# EAGLE design Controller Board v8 (EAGLE 5.06)
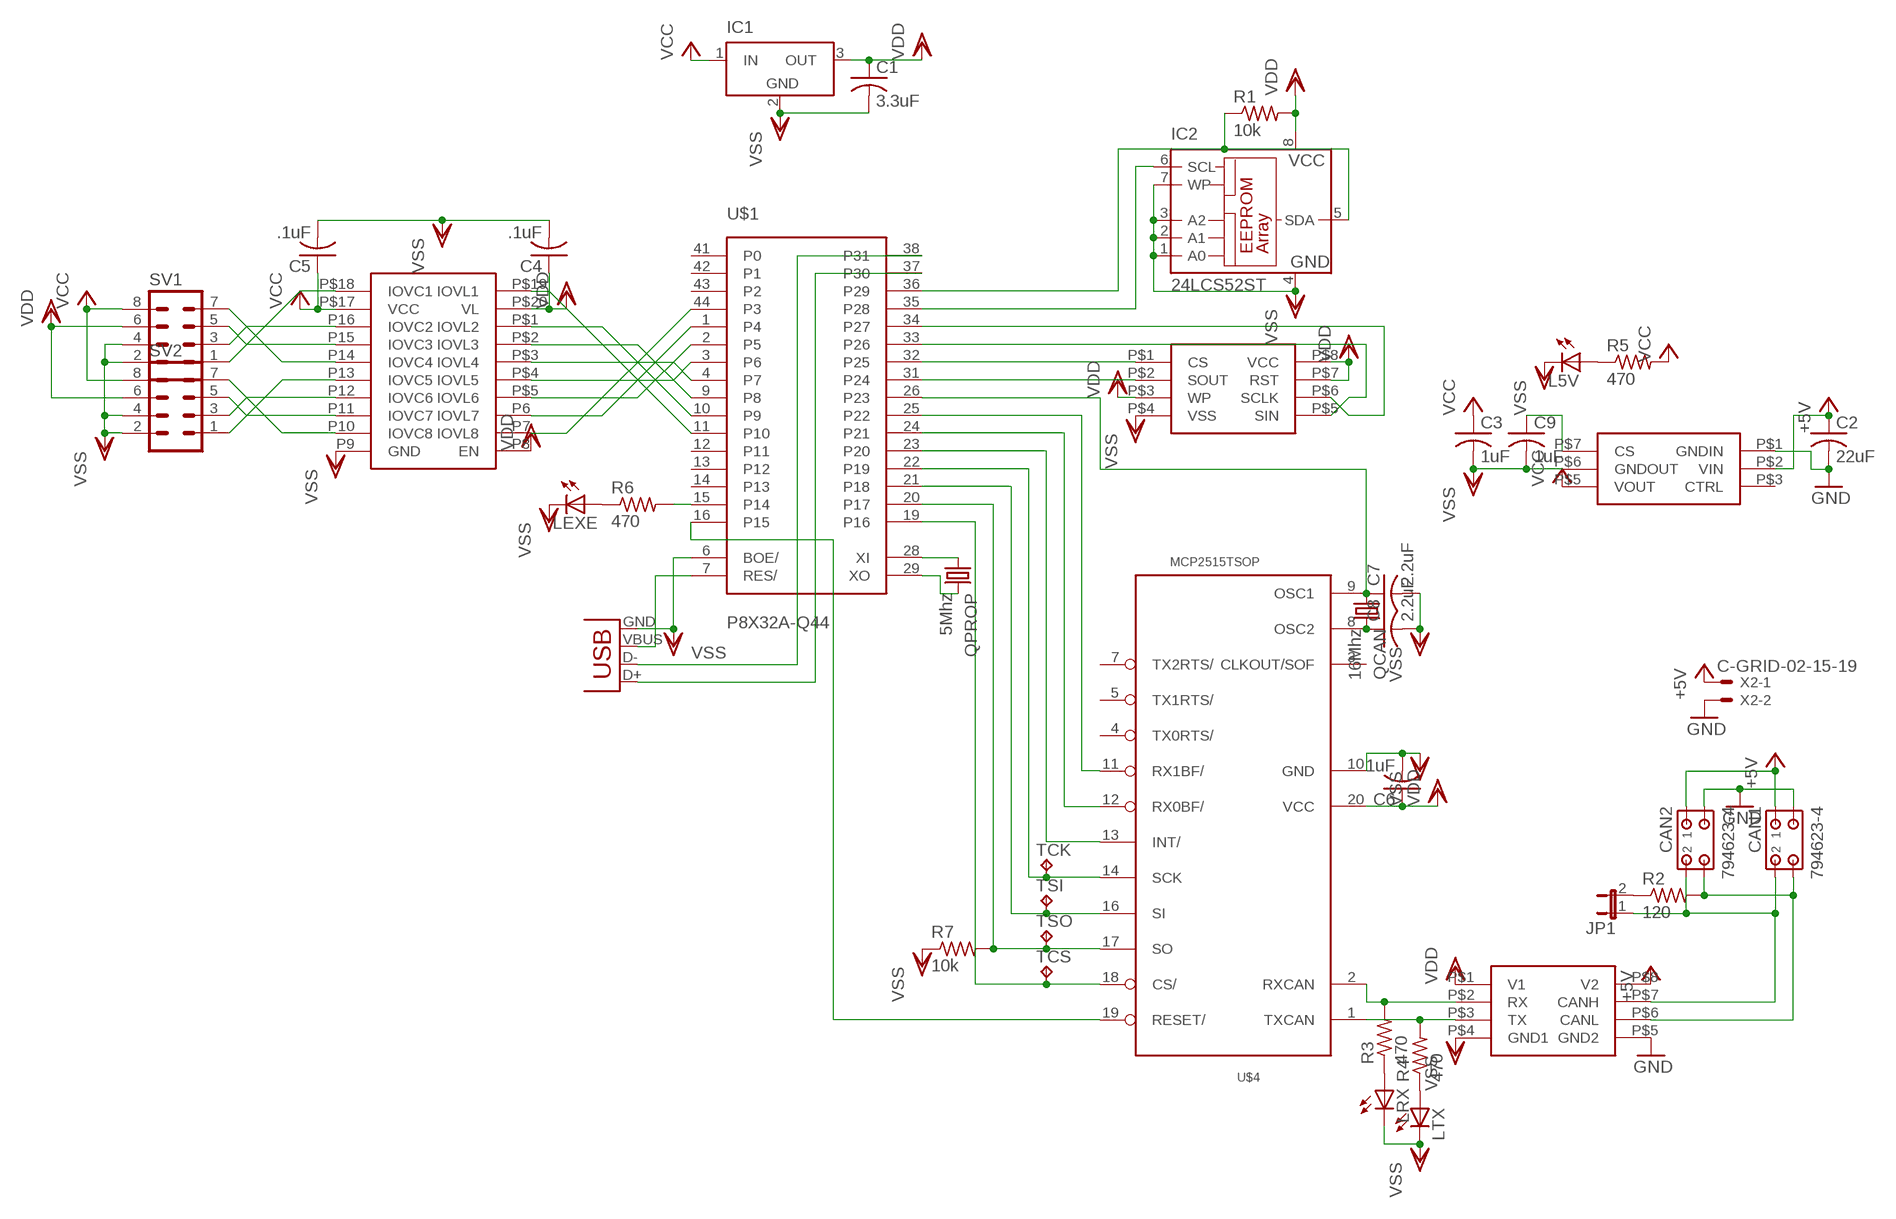
[diagram p0: schematic, sheet 1]

## Parts
C1  3.3uF  C-USC0805  [C0805]
C2  22uF  C-USC1210  [C1210]
C3  1uF  C-USC1210  [C1210]
C4  .1uF  C-USC0805  [C0805]
C5  .1uF  C-USC0805  [C0805]
C6  1uF  C-USC0805  [C0805]
C7  2.2uF  C-USC0805  [C0805]
C8  2.2uF  C-USC0805  [C0805]
C9  1uF  C-USC1210  [C1210]
CAN1  794623-4  [794623-4]
CAN2  794623-4  [794623-4]
IC1  LT1129CST5  [SOT223]
IC2  24LCS52ST  [TSSOP8]
JP1  JP1E  [JP1]
L5V  LEDCHIP-LED0805  [CHIP-LED0805]
LEXE  LEDCHIP-LED0805  [CHIP-LED0805]
LRX  LEDCHIP-LED0805  [CHIP-LED0805]
LTX  LEDCHIP-LED0805  [CHIP-LED0805]
QCAN  16Mhz  CRYSTALHC49UP  [HC49UP]
QPROP  5Mhz  CRYSTALHC49UP  [HC49UP]
R1  10k  R-US_R0603  [R0603]
R2  120  R-US_R0603  [R0603]
R3  470  R-US_R0603  [R0603]
R4  470  R-US_R0603  [R0603]
R5  470  R-US_R0603  [R0603]
R6  470  R-US_R0603  [R0603]
R7  10k  R-US_R0603  [R0603]
SV1  MA04-2  [MA04-2]
SV2  MA04-2  [MA04-2]
TCK  TPPAD1-13  [P1-13]
TCS  TPPAD1-13  [P1-13]
TSI  TPPAD1-13  [P1-13]
TSO  TPPAD1-13  [P1-13]
U$1  P8X32A-Q44  [P8X32A-Q44]
U$2  VINF-VWRBS2  [VINF-VWRBS2]
U$3  TI-ISO1050  [DUB-8]
U$4  MCP2515TSOP  [TSSOP20]
U$5  M25PE20  [S08N]
U$6  MAX3000E  [TQFN-20]
X1  USBSMD  [USB-MINIB]
X2  C-GRID-02-15-19  [15-91-02]

## Nets
+5V: C2.1 CAN1.1 CAN2.1 U$2.P$2(VIN) U$3.P$8(V2) X2.1
FLASHCLK: U$1.34(P27) U$5.P$6(SCLK)
FLASHSIN: U$1.33(P26) U$5.P$5(SIN)
GND: C2.2 CAN1.3 CAN2.3 U$2.P$1(GNDIN) U$3.P$5(GND2) X2.2
N$1: QPROP.1 U$1.28(XI)
N$2: QPROP.2 U$1.29(XO)
N$3: IC2.6(SCL) U$1.35(P28)
N$4: IC2.5(SDA) R1.1 U$1.36(P29)
N$5: U$1.7(RES/) X1.VBUS
N$6: U$1.38(P31) X1.D-
N$7: U$1.37(P30) X1.D+
N$8: U$1.25(P22) U$4.11(RX1BF/)
N$9: U$1.24(P21) U$4.12(RX0BF/)
N$10: CAN1.4 CAN2.4 R2.2 U$3.P$6(CANL)
N$11: CAN1.2 CAN2.2 JP1.1 U$3.P$7(CANH)
N$12: R6.2 U$1.15(P14)
N$13: C9.1 U$2.P$7(CS)
N$14: U$1.32(P25) U$5.P$1(CS)
N$15: U$1.31(P24) U$5.P$2(SOUT)
N$16: U$1.23(P20) U$4.13(INT/)
N$17: TCK.1(TP) U$1.22(P19) U$4.14(SCK)
N$18: C7.1 QCAN.1 U$1.26(P23) U$4.9(OSC1)
N$19: C8.1 QCAN.2 U$4.8(OSC2)
N$20: R3.2 U$3.P$2(RX) U$4.2(RXCAN)
N$21: R4.2 U$3.P$3(TX) U$4.1(TXCAN)
N$22: JP1.2 R2.1
N$23: TSI.1(TP) U$1.21(P18) U$4.16(SI)
N$24: TCS.1(TP) U$1.19(P16) U$4.18(CS/)
N$25: U$1.16(P15) U$4.19(RESET/)
N$26: LRX.A R3.1
N$27: U$1.11(P10) U$6.P$19(IOVL1)
N$28: SV2.7 U$6.P10(IOVC8)
N$29: SV2.5 U$6.P11(IOVC7)
N$30: U$1.10(P9) U$6.P$1(IOVL2)
N$31: U$1.9(P8) U$6.P$2(IOVL3)
N$32: U$1.4(P7) U$6.P$3(IOVL4)
N$33: U$1.3(P6) U$6.P$4(IOVL5)
N$34: U$1.2(P5) U$6.P$5(IOVL6)
N$35: U$1.1(P4) U$6.P6(IOVL7)
N$36: U$1.44(P3) U$6.P7(IOVL8)
N$37: SV2.3 U$6.P12(IOVC6)
N$38: SV2.1 U$6.P13(IOVC5)
N$39: SV1.7 U$6.P14(IOVC4)
N$40: SV1.1 U$6.P$18(IOVC1)
N$41: SV1.3 U$6.P16(IOVC2)
N$42: SV1.5 U$6.P15(IOVC3)
N$44: R7.2 TSO.1(TP) U$1.20(P17) U$4.17(SO)
N$46: LTX.A R4.1
N$47: L5V.A R5.1
N$48: LEXE.A R6.1
VCC: C3.1 C5.1 IC1.1(IN) R5.2 SV1.8 SV2.8 U$2.P$5(VOUT) U$6.P$17(VCC)
VDD: C1.1 C4.1 C6.1 IC1.3(OUT) IC2.8(VCC) R1.2 SV1.6 SV2.6 U$3.P$1(V1) U$4.20(VCC) U$5.P$3(WP) U$5.P$7(RST) U$5.P$8(VCC) U$6.P8(EN) U$6.P$20(VL)
VSS: C1.2 C3.2 C4.2 C5.2 C6.2 C7.2 C8.2 C9.2 IC1.2(GND) IC2.1(A0) IC2.2(A1) IC2.3(A2) IC2.4(GND) IC2.7(WP) L5V.C LEXE.C LRX.C LTX.C R7.1 SV1.2 SV1.4 SV2.2 SV2.4 U$1.6(BOE/) U$2.P$6(GNDOUT) U$3.P$4(GND1) U$4.10(GND) U$5.P$4(VSS) U$6.P9(GND) X1.GND
Unconnected: U$1.12(P11) U$1.13(P12) U$1.14(P13) U$1.41(P0) U$1.42(P1) U$1.43(P2) U$2.P$3(CTRL) U$4.3(CLKOUT/SOF) U$4.4(TX0RTS/) U$4.5(TX1RTS/) U$4.7(TX2RTS/)

## Power pins joined to a net without a drawn wire
VDD: U$1.8(VDD) U$1.18(VDD) U$1.30(VDD) U$1.40(VDD)
VSS: IC1.4(GND) U$1.5(VSS) U$1.17(VSS) U$1.27(VSS) U$1.39(VSS)

## Library data of the parts
C1-C9 = rcl:C-US: CAPACITOR, American symbol
CAN1 CAN2 = con-amp:794623-4: MICRO MATE N LOK Dual Row, grid 1.5 mm Source: http://catalog.tycoelectronics.com .. ENG_CD_794623_F.pdf
IC1 = linear-technology:LT1129CST5: VOLTAGE REGULATOR with shutdown
IC2 = microchip:24*: Serial EEPROM I2C
JP1 = jumper:JP1E: JUMPER
L5V LEXE LRX LTX = led:LED: LED OSRAM: - CHIPLED LG R971, LG N971, LY N971, LG Q971, LY Q971, LO R971, LY R971 LH N974, LH R974 LS Q976, LO Q976, LY Q976 LO Q996 - Hyper CHIPLED LW Q18S LB Q993, LB Q99A, LB R99A - SideLED LS A670, LO A670, LY A670, LG A670, LP A670 LB A673, LV A673, LT A673, LW A673 LH A674 LY A675 LS A676, LA A676, LO A676, LY A676, LW A676 LS A679, LY A679, LG A679 - Hyper Micro SIDELED® LS Y876, LA Y876, LO Y876, LY Y876 LT Y87S - SmartLED LW L88C, LW L88S LB L89C, LB L89S, LG L890 LS L89K, LO L89K, LY L89K LS L896, LA L896, LO L896, LY L896 - TOPLED LS T670, LO T670, LY T670, LG T670, LP T670 LSG T670, LSP T670, LSY T670, LOP T670, LYG T670 LG T671, LOG T671, LSG T671 LB T673, LV T673, LT T673, LW T673 LH T674 LS T676, LA T676, LO T676, LY T676, LB T676, LH T676, LSB T676, LW T676 LB T67C, LV T67C, LT T67C, LS T67K, LO T67K, LY T67K, LW E67C LS E67B, LA E67B, LO E67B, LY E67B, LB E67C, LV E67C, LT E67C LW T67C LS T679, LY T679, LG T679 LS T770, LO T770, LY T770, LG T770, LP T770 LB T773, LV T773, LT T773, LW T773 LH T774 LS E675, LA E675, LY E675, LS T675 LS T776, LA T776, LO T776, LY T776, LB T776 LHGB T686 LT T68C, LB T68C - Hyper Mini TOPLED® LB M676 - Mini TOPLED Santana® LG M470 LS M47K, LO M47K, LY M47K Source: http://www.osram.convergy.de LUXEON: - LUMILED® LXK2-PW12-R00, LXK2-PW12-S00, LXK2-PW14-U00, LXK2-PW14-V00 LXK2-PM12-R00, LXK2-PM12-S00, LXK2-PM14-U00 LXK2-PE12-Q00, LXK2-PE12-R00, LXK2-PE12-S00, LXK2-PE14-T00, LXK2-PE14-U00 LXK2-PB12-K00, LXK2-PB12-L00, LXK2-PB12-M00, LXK2-PB14-N00, LXK2-PB14-P00, LXK2-PB14-Q00 LXK2-PR12-L00, LXK2-PR12-M00, LXK2-PR14-Q00, LXK2-PR14-R00 LXK2-PD12-Q00, LXK2-PD12-R00, LXK2-PD12-S00 LXK2-PH12-R00, LXK2-PH12-S00 LXK2-PL12-P00, LXK2-PL12-Q00, LXK2-PL12-R00 Source: www.luxeon.com KINGBRIGHT: KA-3528ASYC Source: www.kingbright.com
QCAN QPROP = crystal:CRYSTAL: CRYSTAL
R1-R7 = rcl:R-US_: RESISTOR, American symbol
SV1 SV2 = con-lstb:MA04-2: PIN HEADER
TCK TCS TSI TSO = testpad:TP: Test pad
U$1 = parallax_propeller:P8X32A-Q44
U$2 = dc-dc-converter:VINF-VWRBS2
U$3 = isodcdc:TI-ISO1050
U$4 = MCP2515_MT:MCP2515*: MCP2515 Standalone CAN-Controller by Microchip Eagle-Lib. by MartinThomas
U$5 = Flash:M25PE20
U$6 = Level Shifters:MAX3000E
X1 = SparkFun:USB: USB Connectors USB-B-PTH is fully proven SKU : PRT-00139 USB-miniB is fully proven SKU : PRT-00587 USB-A-PCB is untested. USB-A-H is throughly reviewed, but untested. Spark Fun Electronics SKU : PRT-00437 USB-B-SMT is throughly reviewed, but untested. Needs silkscreen touching up. USB-A-S has not been used/tested USB-MB-H has not been used/tested
X2 = con-molex:C-GRID-02: CONNECTOR wire to board 2.54 mm (0.100") pitch header

## Board
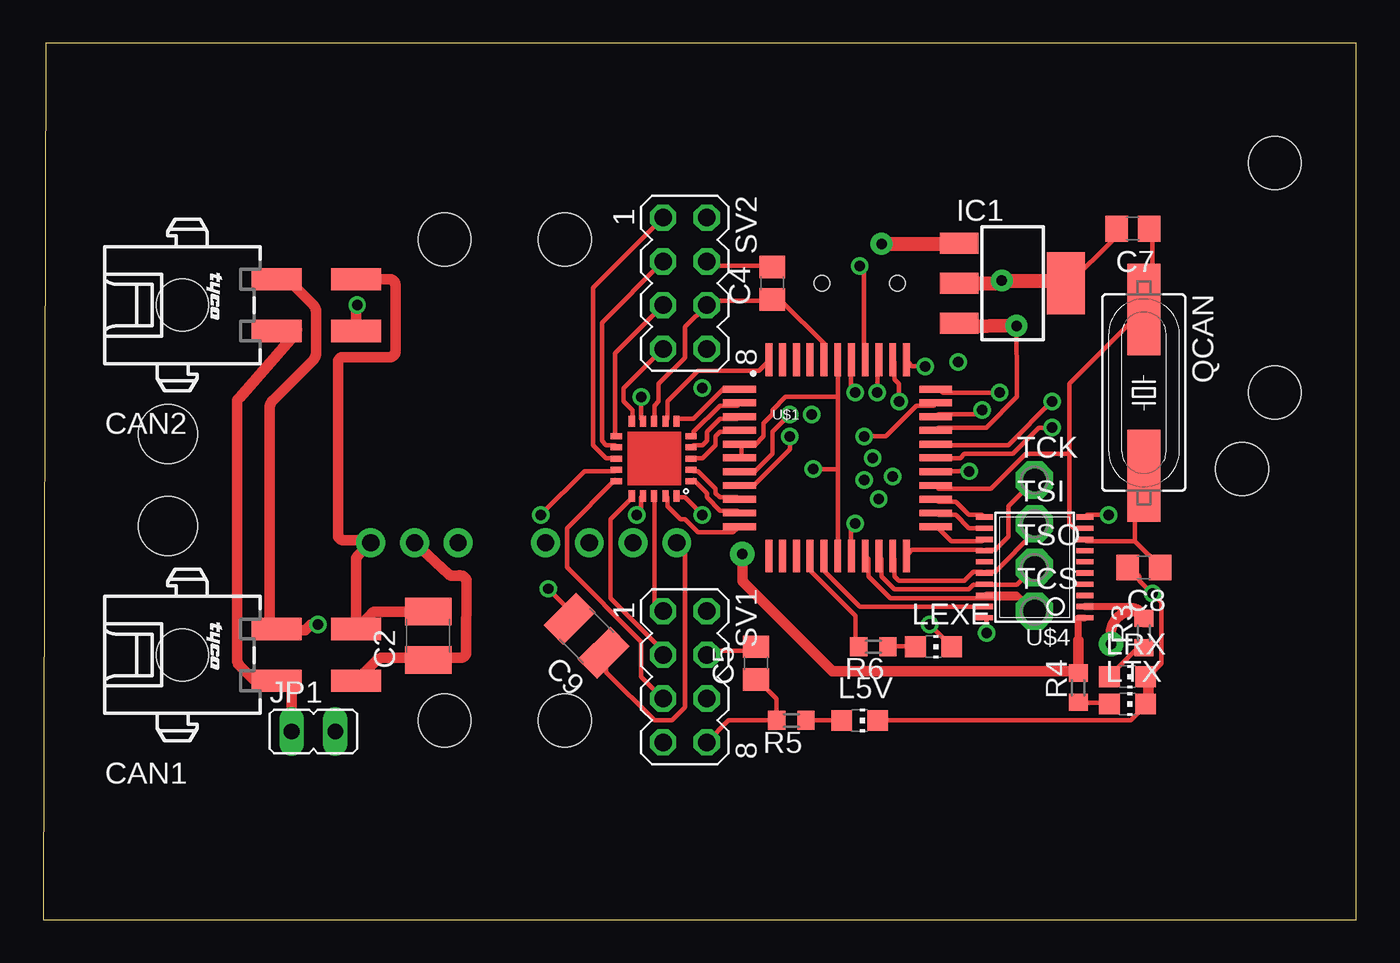
[diagram p1: board, top side]
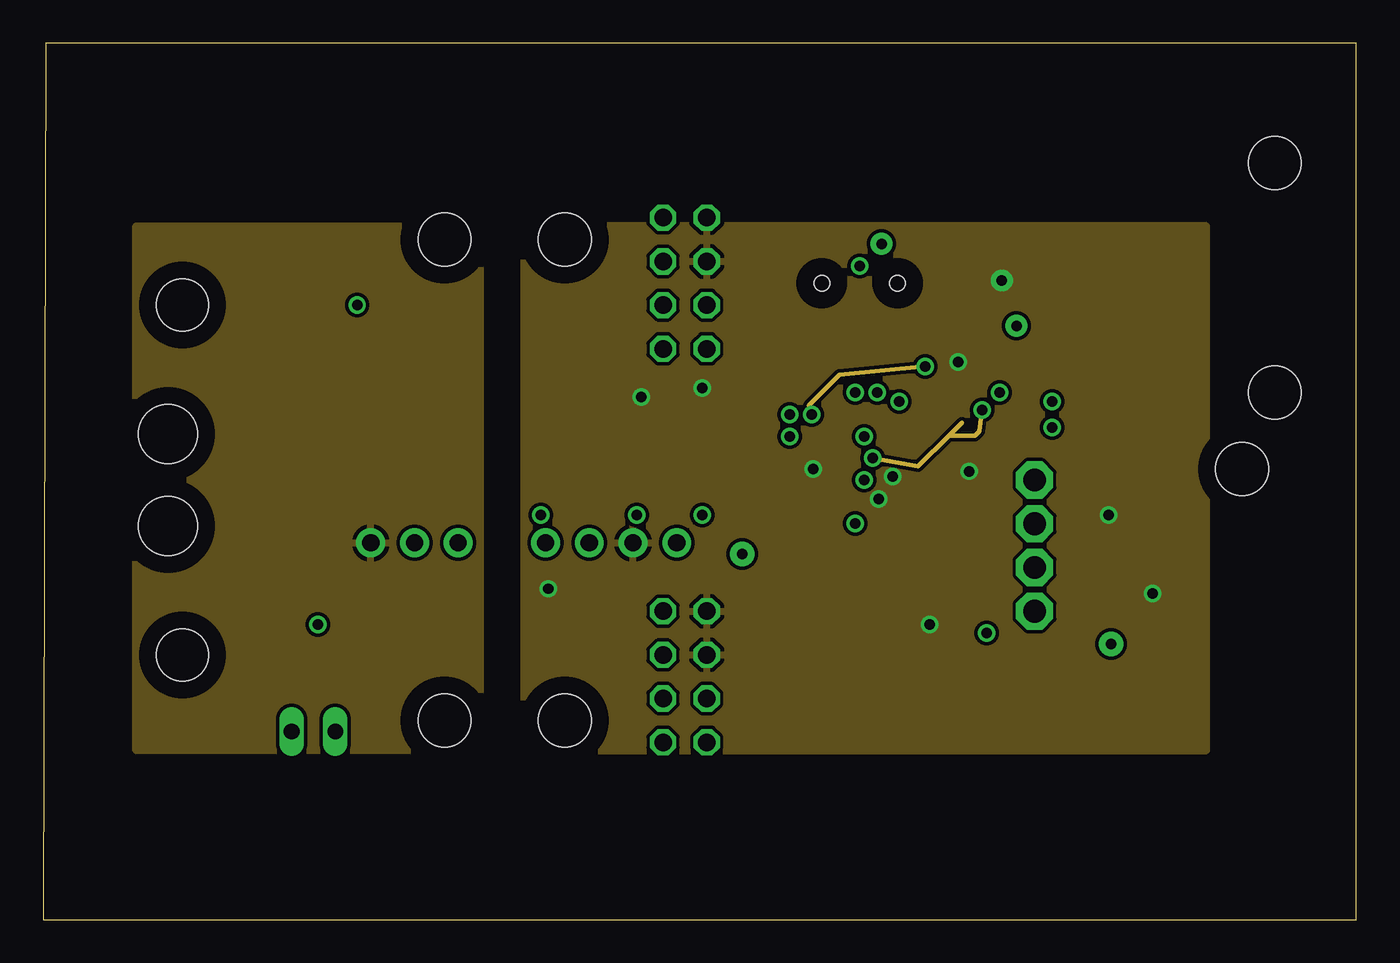
[diagram p2: board, inner layer Route2]
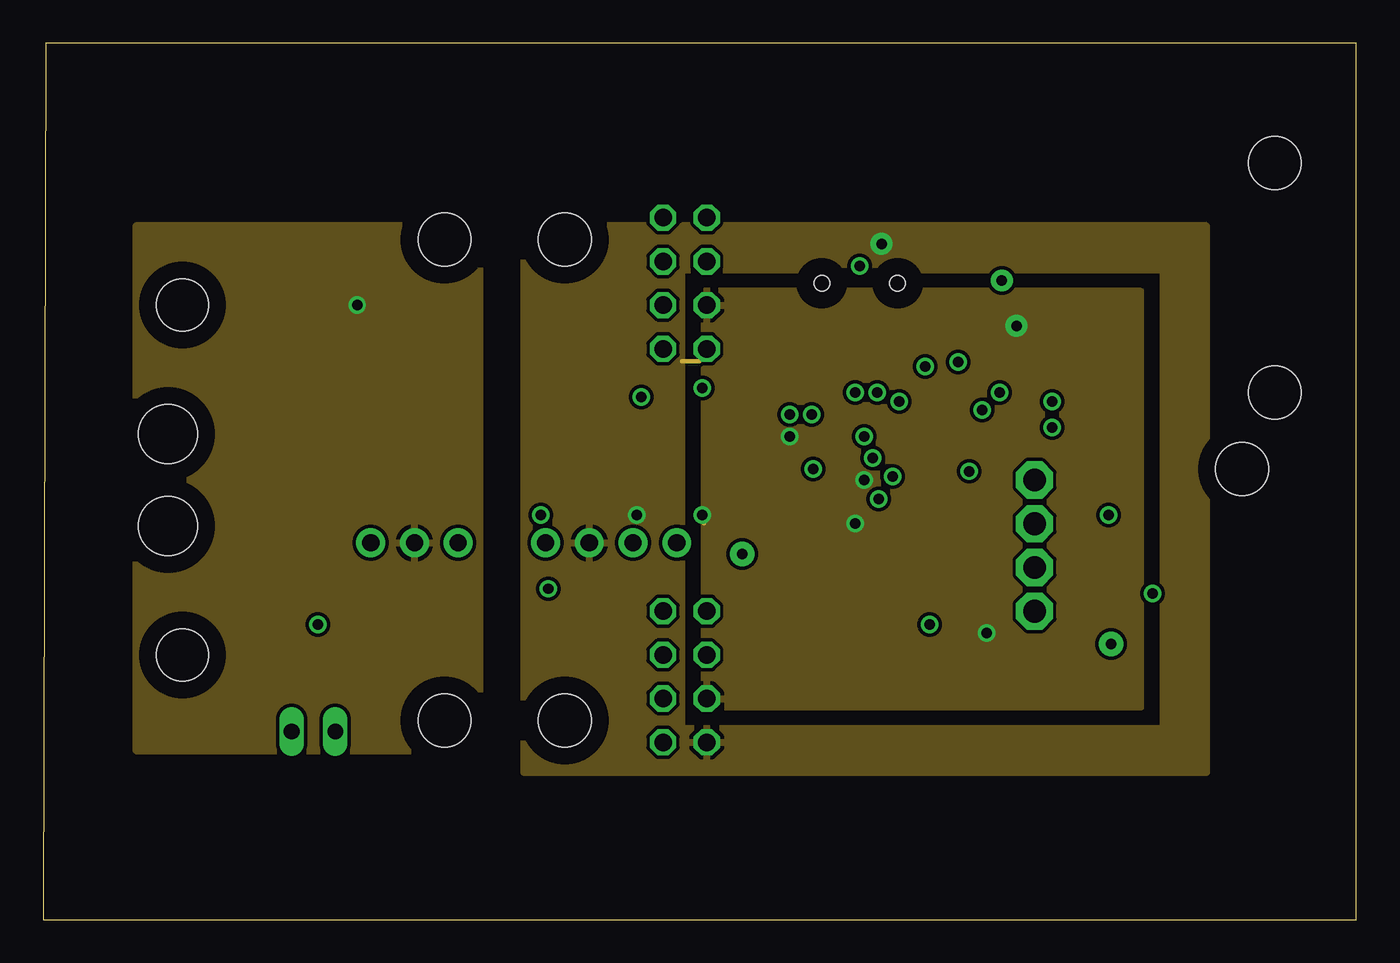
[diagram p3: board, inner layer Route15]
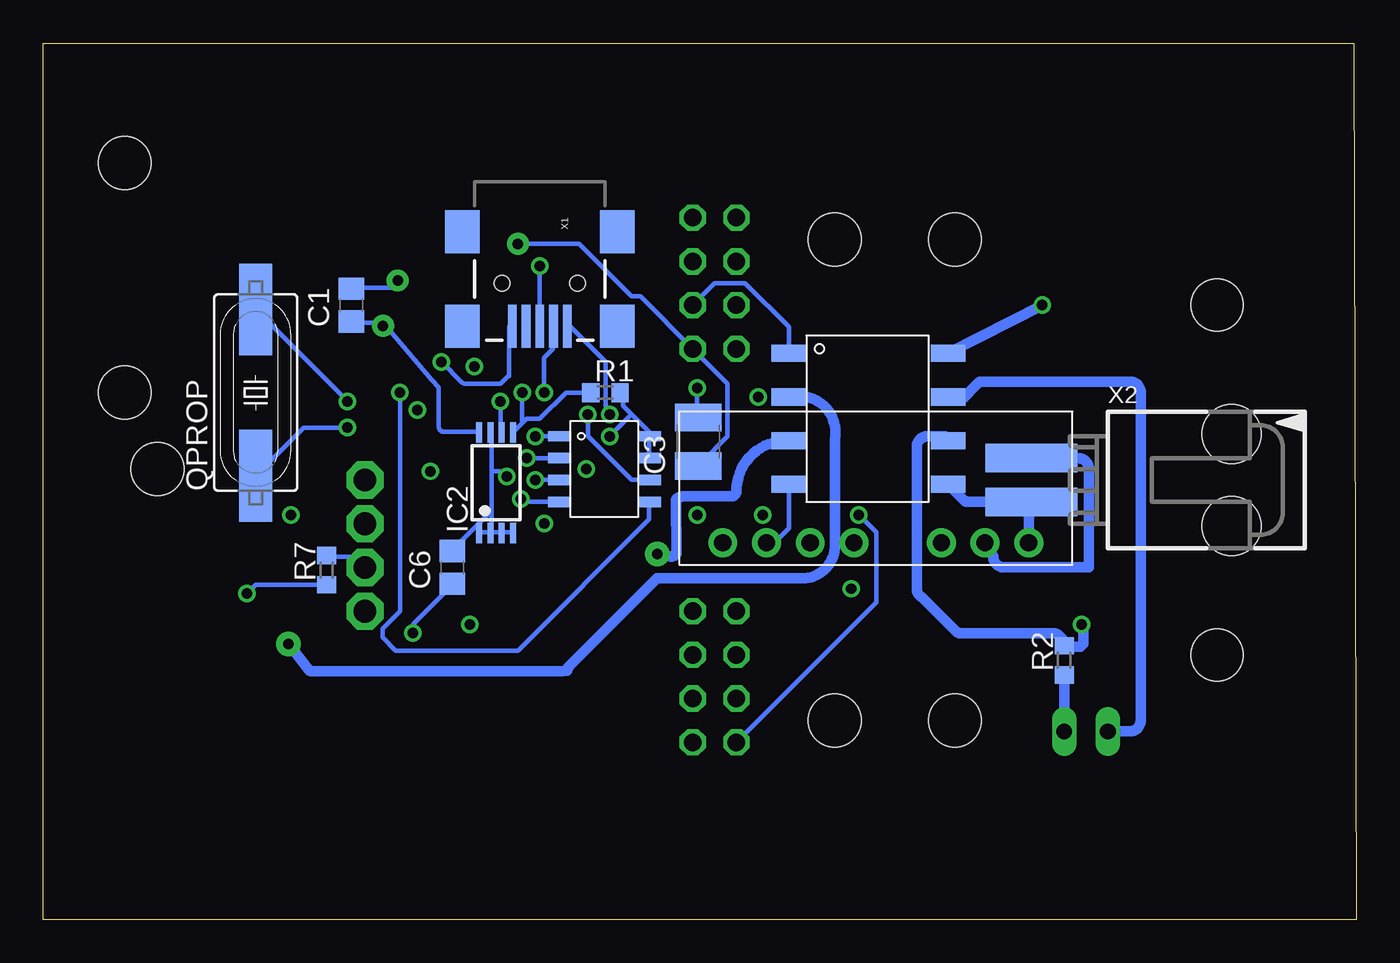
[diagram p4: board, bottom side, seen from below]

Size 76.34 x 50.95 mm. Coordinates in mm from the lower left corner, seen from the top.
Outline: 0,0 76.34,0 76.34,50.95 0.16,50.95 0,0
Copper layers (1*2+15*16): Top 0.035mm / dielectric 0.2mm / Route2 0.035mm / dielectric 1.5mm / Route15 0.035mm / dielectric 0.2mm / Bottom 0.035mm
Design rules "4 layer": minimum track width 10mil, minimum drill 24mil, track to track 8mil, track to pad 8mil, pad to pad 8mil, via to via 8mil, smd to smd 8mil, copper to edge 40mil, drill to drill 8mil, minimum pad ring 10mil, minimum via ring 8mil, stop-mask expansion 4mil, vias tented up to drill 0mil, thermal gap 10mil
Holes 3.05 mm at 71.6,30.64 71.6,43.97 30.32,39.53 30.32,11.59 69.69,26.19 23.34,39.53 23.34,11.59
tRestrict: area 26.5,12.9 to 27.1,38.9

### Footprints (pad centres in the part's own frame; a part is rotated, then mirrored left to right if it is on the bottom)
C0805 = smd 1.3 x 1.5: 1 -0.95,0; 2 0.95,0
C1210 = smd 1.6 x 2.7: 1 -1.4,0; 2 1.4,0
794623-4 = smd 1.3 x 2.92: 1 1.5,10.1; 2 1.5,5.48; 3 -1.5,10.1; 4 -1.5,5.48 | hole 3: 0,0
SOT223 = smd 1.219 x 2.235: 1 -2.311,-3.099; 2 0,-3.099; 3 2.311,-3.099 | smd 3.6 x 2.2: 4 0,3.099
TSSOP8 = smd 0.35 x 1.2: 1 -0.975,-2.925; 2 -0.325,-2.925; 3 0.325,-2.925; 4 0.975,-2.925; 5 0.975,2.925; 6 0.325,2.925; 7 -0.325,2.925; 8 -0.975,2.925
JP1 = drill 0.914 long: 1 0,-1.27; 2 0,1.27
CHIP-LED0805 = smd 1.2 x 1.2: A 0,-1.05; C 0,1.05
HC49UP = smd 5.334 x 1.93: 1 -4.826,0; 2 4.826,0
R0603 = smd 1 x 1.1: 1 -0.85,0; 2 0.85,0
MA04-2 = drill 1.016 octagon: 1 -3.81,-1.27; 2 -3.81,1.27; 3 -1.27,-1.27; 4 -1.27,1.27; 5 1.27,-1.27; 6 1.27,1.27; 7 3.81,-1.27; 8 3.81,1.27
P1-13 = drill 1.321 pad 2.159 octagon: 1 0,0
P8X32A-Q44 = smd 1.9 x 0.4: 1 -5.713,4.013; 2 -5.713,3.212; 3 -5.713,2.413; 4 -5.713,1.613; 5 -5.713,0.812; 6 -5.713,0.013; 7 -5.713,-0.787; 8 -5.713,-1.587; 9 -5.713,-2.388; 10 -5.713,-3.188; 11 -5.713,-3.987; 23 5.688,-3.987; 24 5.688,-3.188; 25 5.688,-2.388; 26 5.688,-1.587; 27 5.688,-0.787; 28 5.688,0.013; 29 5.688,0.812; 30 5.688,1.613; 31 5.688,2.413; 32 5.688,3.212; 33 5.688,4.013 | smd 0.4 x 1.9: 12 -4.013,-5.688; 13 -3.212,-5.688; 14 -2.413,-5.688; 15 -1.613,-5.688; 16 -0.812,-5.688; 17 -0.013,-5.688; 18 0.787,-5.688; 19 1.587,-5.688; 20 2.388,-5.688; 21 3.188,-5.688; 22 3.987,-5.688; 34 3.987,5.713; 35 3.188,5.713; 36 2.388,5.713; 37 1.587,5.713; 38 0.787,5.713; 39 -0.013,5.713; 40 -0.812,5.713; 41 -1.613,5.713; 42 -2.413,5.713; 43 -3.212,5.713; 44 -4.013,5.713
VINF-VWRBS2 = drill 1 pad 1.676 round: P$1 -12.7,5.08; P$2 -10.16,5.08; P$3 -7.62,5.08; P$4 -2.54,5.08; P$5 0,5.08; P$6 2.54,5.08; P$7 5.08,5.08
DUB-8 = smd 2 x 1: P$1 -4.572,3.556; P$2 -4.572,1.016; P$3 -4.572,-1.524; P$4 -4.572,-4.064; P$5 4.678,-4.064; P$6 4.678,-1.524; P$7 4.678,1.016; P$8 4.678,3.556
TSSOP20 = smd 0.305 x 0.991: 1 -2.925,-2.918; 2 -2.275,-2.918; 3 -1.625,-2.918; 4 -0.975,-2.918; 5 -0.325,-2.918; 6 0.325,-2.918; 7 0.975,-2.918; 8 1.625,-2.918; 9 2.275,-2.918; 10 2.925,-2.918; 11 2.925,2.918; 12 2.275,2.918; 13 1.625,2.918; 14 0.975,2.918; 15 0.325,2.918; 16 -0.325,2.918; 17 -0.975,2.918; 18 -1.625,2.918; 19 -2.275,2.918; 20 -2.925,2.918
S08N = smd 0.6 x 1.3: P$1 -2.54,-2.667; P$2 -1.27,-2.667; P$3 0,-2.667; P$4 1.27,-2.667; P$5 1.27,2.587; P$6 0,2.587; P$7 -1.27,2.587; P$8 -2.54,2.587
TQFN-20 = smd 0.65 x 0.35: P6 0.875,-1.1; P7 0.875,-0.45; P8 0.875,0.2; P9 0.875,0.85; P10 0.875,1.5; P16 -3.475,1.5; P$17 -3.475,0.85; P$18 -3.475,0.2; P$19 -3.475,-0.45; P$20 -3.475,-1.1 | smd 0.35 x 0.65: P11 0,2.4; P12 -0.65,2.4; P13 -1.3,2.4; P14 -1.95,2.4; P15 -2.6,2.4; P$1 -2.6,-1.95; P$2 -1.95,-1.95; P$3 -1.3,-1.95; P$4 -0.65,-1.95; P$5 0,-1.95
USB-MINIB = smd 2.5 x 0.5: D+ 2.5,0; D- 2.5,0.8; GND 2.5,-1.6; ID 2.5,-0.8; VBUS 2.5,1.6 | smd 2.5 x 2: GND@1 -3,-4.5; GND@2 -3,4.5; GND@3 2.5,4.5; GND@4 2.5,-4.5 | hole 0.9: 0,2.2; 0,-2.2
15-91-02 = smd 1.651 x 5.334: 1 -1.27,-10.795; 2 1.27,-10.795 | hole 3.404: -2.667,0.838; 2.667,0.838

### Placement (x,y rotation side)
C1  58.42,35.72 90 bottom
C2  22.38,16.51 90 top
C3  38.26,27.78 90 bottom
C4  42.39,36.99 90 top
C5  41.43,14.92 90 top
C6  52.55,20.48 90 bottom
C7  63.34,40.16 180 top
C8  63.98,20.48 180 top
C9  31.59,16.51 135 top
CAN1  8.1,15.4 270 top
CAN2  8.1,35.72 270 top
IC1  56.36,36.99 270 top
IC2  50.01,25.4 0 bottom
JP1  15.72,10.95 270 top
L5V  47.47,11.59 270 top
LEXE  51.75,15.88 270 top
LRX  63.02,14.13 270 top
LTX  63.02,12.54 270 top
QCAN  63.98,30.64 270 top
QPROP  63.98,30.64 90 bottom
R1  43.66,30.64 0 bottom
R2  16.99,15.08 90 bottom
R3  63.98,16.67 90 top
R4  60.17,13.49 90 top
R5  43.5,11.59 180 top
R6  48.26,15.87 180 top
R7  59.85,20.32 90 bottom
SV1  37.31,14.13 270 top
SV2  37.31,36.99 270 top
TCK  57.63,25.56 0 top
TCS  57.63,17.94 0 top
TSI  57.63,23.02 0 top
TSO  57.63,20.48 0 top
U$1  46.2,26.83 0 top
U$2  31.75,26.99 180 bottom
U$3  28.42,29.37 0 bottom
U$4  57.63,20.48 90 top
U$5  43.66,25.56 270 bottom
U$6  35.72,28.1 90 top
X1  47.47,36.99 270 bottom
X2  8.1,25.56 270 bottom

### Tracks (layer width: path | path; a pad name or v marks a point on that pad's centre or on a via)
+5V  (via drill 0.61)
  Top 0.254: CAN2.1 18.26,34.45 | C2.1 22.32,15.14 22.32,15.24
  Top 0.61: v18.26,35.72 18.2,35.66 CAN2.1 | CAN1.1 19.35,15.05 arc-45 19.8,15.24 | 19.8,15.24 22.32,15.24 23.38,15.24 arc45 23.26,15.32 arc-45 23.07,15.51 22.9,15.52 | 19.8,15.24 24.28,15.24 arc92 24.6,15.57 24.62,19.7 arc88 24.14,20 23.78,20 arc-43 23.56,20.09 U$2.P$2
  Bottom 0.61: v18.26,35.72 U$3.P$8 | X2.1 16.19,26.83 arc90 15.56,26.19 15.56,20.48 20.48,20.48 arc90 21.11,21.11 U$2.P$2
  pour Route15: 5.4,40.32 5.4,9.84 25.4,9.84 25.4,40.32
FLASHCLK  (via drill 0.61)
  Top 0.254: v51.28,32.16 50.51,32.16 50.26,32.42 U$1.34
  Route2 0.254: v44.67,29.37 44.51,29.91 46.29,31.69 v51.28,32.16
  Bottom 0.254: v44.67,29.37 44.67,28.1 42.13,25.56 U$5.P$6
FLASHSIN  (via drill 0.61)
  Top 0.254: v55.59,30.64 52.29,30.64 52.04,30.89 U$1.33
  Bottom 0.254: v55.59,30.64 55.59,17.94 56.61,16.92 56.61,16.41 55.85,15.65 48.74,15.65 41.12,23.27 41.12,24.29 U$5.P$5
GND
  Top 0.61: C2.2 19.34,17.91 arc45 19.11,17.82 CAN1.3 18.2,20.92 arc-45 18.29,21.15 U$2.P$1 arc90 18.89,22.07 17.46,22.07 arc-90 17.15,22.38 17.15,32.39 arc-90 17.46,32.7 20.16,32.7 arc90 20.48,33.02 20.48,36.9 arc90 20.16,37.22 CAN2.3
  Bottom 0.61: U$2.P$1 19.05,24.13 arc90 X2.2 22.59,24.29 arc45 22.82,24.38 U$3.P$5
  pour Route2: 25.4,40.32 25.4,9.84 5.4,9.84 5.4,40.32
N$1  (via drill 0.61)
  Top 0.254: v58.64,28.61 57.88,28.61 56.36,27.08 53.56,27.08 53.31,26.83 52.04,26.83 U$1.28
  Bottom 0.254: v58.64,28.61 61.18,28.61 QPROP.1
N$2  (via drill 0.61)
  Top 0.254: v58.64,30.13 56.1,27.59 52.04,27.59 U$1.29
  Bottom 0.254: v58.64,30.13 QPROP.2
N$3  (via drill 0.61)
  Top 0.254: v49.75,30.13 49.75,31.15 49.5,31.4 49.5,32.42 U$1.35
  Bottom 0.254: v49.75,30.13 49.75,28.35 IC2.6
N$4  (via drill 0.61)
  Top 0.254: v48.48,30.64 48.48,32.42 U$1.36
  Bottom 0.254: 48.48,28.86 48.99,28.35 IC2.5 | 48.48,28.86 48.23,29.11 47.47,29.11 45.94,30.64 R1.1 | 48.48,28.86 v48.48,30.64
N$5  (via drill 0.61)
  Top 0.254: v43.4,29.37 42.39,28.35 42.39,27.08 41.37,26.07 40.61,26.07 U$1.7
  Bottom 0.254: v43.4,29.37 43.4,29.62 43.66,29.88 43.66,32.42 45.69,34.45 X1.VBUS
N$6  (via drill 0.61)
  Top 0.254: v47.21,30.64 46.96,30.89 46.96,32.42 U$1.38
  Bottom 0.254: v47.21,30.64 47.21,32.67 46.7,33.18 46.7,34.45 X1.D-
N$7  (via drill 0.61)
  Top 0.254: v47.47,38 47.72,37.75 47.72,32.67 U$1.37
  Bottom 0.254: v47.47,38 X1.D+
N$8
  Top 0.254: U$4.11 54.58,23.53 53.82,23.53 53.05,24.29 52.04,24.29 U$1.25
N$9
  Top 0.254: U$1.24 52.04,23.53 53.05,23.53 53.82,22.76 54.58,22.76 U$4.12
N$10  (via drill 0.61)
  Top 0.254: CAN2.4 13.68,36.99 | 13.68,16.92 13.68,17.18 CAN1.4 13.68,16.92
  Top 0.61: 13.68,17.18 13.3,17.18 13.18,17.3 13.18,29.74 arc-45 13.36,30.19 15.69,32.52 arc45 15.88,32.97 15.88,35.3 arc45 15.69,35.75 14.22,37.22 CAN2.4 | v15.97,17.18 15.88,17.15 15.56,17.15 15.24,16.83 13.65,16.83 CAN1.4
  Bottom 0.61: v15.97,17.18 15.88,17.15 15.88,16.03 16.03,15.88 16.83,15.88 R2.2 arc-90 17.72,16.67 23.07,16.67 arc45 23.36,16.85 25.21,18.71 arc45 25.56,19.15 25.56,27.46 arc90 24.92,28.1 23.97,28.1 arc90 23.74,27.87 U$3.P$6
N$11
  Top 0.254: CAN1.2 13.68,14.13 | CAN1.2 13.68,13.87 | JP1.1 14.45,11.08 | CAN2.2 13.43,34.19 | CAN1.2 13.43,14.13
  Top 0.61: CAN2.2 13.65,34.29 14.76,34.29 14.61,33.97 11.43,30.34 arc18 11.27,30.16 11.27,29.37 11.27,15.19 arc45 11.46,14.74 12.22,13.97 13.49,13.97 CAN1.2 13.81,13.97 14.29,13.97 14.45,13.81 JP1.1
  Bottom 0.61: U$3.P$7 23.65,30.32 22.86,30.32 22.09,31.09 arc45 21.8,31.27 13.18,31.27 arc90 12.54,30.64 12.54,11.59 arc90 13.18,10.95 JP1.1
N$12
  Top 0.254: R6.2 47.21,15.91 47.21,17.68 44.67,20.22 44.67,20.99 U$1.15
N$13
  Top 0.254: 32.23,15.91 C9.1 32.73,15.4 32.73,14.38 35.53,11.59 36.54,11.59 37.31,12.35 37.31,21.49 37.05,21.75 U$2.P$7
N$14  (via drill 0.61)
  Top 0.254: v47.72,28.1 48.99,28.1 50.77,29.88 51.78,29.88 U$1.32
  Bottom 0.254: U$5.P$1 v47.72,28.1
N$15  (via drill 0.61)
  Top 0.254: v54.58,29.62 54.32,29.37 52.04,29.37 U$1.31
  Route2 0.254: v48.23,26.83 50.86,26.35 52.64,28.13 | 52.64,28.13 53.4,28.89 | v54.58,29.62 54.42,28.38 54.17,28.13 52.64,28.13
  Bottom 0.254: U$5.P$2 v48.23,26.83
N$16
  Top 0.254: U$4.13 54.58,22 52.8,22 52.04,22.76 U$1.23
N$17
  Top 0.254: U$1.22 50.26,21.24 50.51,21.49 54.58,21.49 U$4.14 54.83,21.49 55.34,21.49 56.1,22.26 56.1,24.03 TCK.1 | TCK.1
N$18
  Top 0.254: 59.66,27.08 59.66,31.15 QCAN.1 64.48,35.97 | 59.66,27.08 59.66,23.02 59.91,22.76 60.42,22.76 U$4.9 | 64.48,35.97 64.74,36.23 | 59.66,27.08 57.12,27.08 55.09,25.05 52.04,25.05 U$1.26 | 64.48,35.97 64.48,40.04 C7.1
N$19
  Top 0.254: 63.47,22 60.67,22 U$4.8 | 63.47,22 64.99,20.48 C8.1 | 63.47,22 63.47,25.3 QCAN.2
N$20  (via drill 0.61 pad 1.42)
  Top 0.406: U$4.2 63.29,18.2 arc-90 R3.2
  Top 0.61: R3.2 arc90 64.19,17.3 | R3.2 63.98,17.3 | v62.07,16.03 62.07,16.67 arc-90 63.34,17.94 63.56,17.94 arc-90 R3.2
  Bottom 0.61: U$3.P$2 31.97,30.38 arc90 30.32,27.94 30.32,21.59 arc90 32.39,19.84 40.64,19.84 45.79,14.7 arc-45 45.88,14.47 46.18,14.45 arc5 46.21,14.45 60.67,14.45 arc45 60.89,14.54 v62.07,16.03
N$21  (via drill 0.61 pad 1.42)
  Top 0.406: 60.17,16.25 60.17,17.55 U$4.1
  Top 0.61: R4.2 60.17,14.13 | R4.2 60.17,16.25 | R4.2 R4.2 arc45 59.93,14.45 45.88,14.45 40.73,19.59 arc-45 40.64,19.82 v40.64,21.27
  Bottom 0.61: U$3.P$3 33.12,27.84 arc-90 36.04,24.92 arc90 36.35,24.61 39.11,24.61 arc-45 39.56,24.42 39.53,21.28 39.6,21.21 arc45 39.82,21.11 v40.64,21.27
N$22
  Bottom 0.61: JP1.2 R2.1
N$23
  Top 0.254: TSI.1 57.63,22.51 55.34,20.22 54.83,20.22 U$4.16 54.58,20.22 54.07,20.22 53.56,19.72 49.75,19.72 49.5,19.97 49.5,20.99 U$1.21
N$24
  Top 0.254: 56.86,18.7 56.61,18.95 54.83,18.95 U$4.18 | 56.86,18.7 49.24,18.7 47.97,19.97 47.97,20.99 U$1.19 | 56.86,18.7 TCS.1
N$25
  Top 0.254: U$4.19 54.58,18.19 47.47,18.19 45.43,20.22 45.43,20.99 U$1.16
N$26
  Top 0.254: R3.1 63.98,15.65 63.47,15.65 61.94,14.13 LRX.A
N$27
  Top 0.254: U$6.P$19 36.29,24.54 36.29,24.03 37.05,23.27 37.31,23.27 38.07,22.51 40.1,22.51 40.35,22.76 U$1.11
N$28
  Top 0.254: SV2.7 33.75,30.89 33.75,30.13 34.26,29.62 34.26,29.11 U$6.P10
N$29
  Top 0.254: SV2.5 33.24,32.92 33.24,28.1 U$6.P11
N$30
  Top 0.254: U$6.P$1 37.81,25.56 38.58,24.8 38.58,24.54 39.34,23.78 40.35,23.78 U$1.10
N$31
  Top 0.254: U$6.P$2 37.81,26.07 38.07,26.07 39.08,25.05 39.08,24.8 39.34,24.54 40.35,24.54 U$1.9
N$32
  Top 0.254: U$6.P$3 37.81,26.83 38.32,26.83 39.08,27.59 39.08,28.1 39.34,28.35 40.35,28.35 U$1.4
N$33
  Top 0.254: U$6.P$4 37.81,27.59 38.32,27.59 38.58,27.84 38.58,28.35 39.34,29.11 40.35,29.11 U$1.3
N$34
  Top 0.254: U$6.P$5 37.81,28.1 37.81,28.35 39.34,29.88 40.35,29.88 U$1.2
N$35
  Top 0.254: U$6.P6 36.8,29.11 37.81,29.11 39.59,30.89 40.35,30.89 U$1.1
N$36
  Top 0.254: U$6.P7 36.29,29.11 36.29,30.13 38.07,31.91 41.62,31.91 42.13,32.42 U$1.44
N$37
  Top 0.254: SV2.3 32.48,34.7 32.48,27.84 32.73,27.59 33.24,27.59 U$6.P12
N$38
  Top 0.254: SV2.1 31.97,36.73 31.97,27.59 32.73,26.83 33.24,26.83 U$6.P13
N$39  (via drill 0.61)
  Top 0.254: v28.92,23.53 31.46,26.07 33.24,26.07 U$6.P14
  Bottom 0.254: v28.92,23.53 27.91,22.51 27.91,18.45 SV1.7
N$40
  Top 0.254: SV1.1 35.53,18.45 35.53,24.54 U$6.P$18
N$41
  Top 0.254: SV1.3 36.04,15.65 32.99,18.7 32.99,23.27 34.26,24.54 U$6.P16
N$42
  Top 0.254: SV1.5 34.77,14.13 34.77,16.16 30.45,20.48 30.45,22.76 33.24,25.56 U$6.P15
N$44
  Top 0.254: TSO.1 56.61,19.46 54.83,19.46 U$4.17 54.58,19.46 54.07,19.46 53.82,19.21 49.5,19.21 48.74,19.97 48.74,20.99 U$1.20
  Bottom 0.254: TSO.1 58.26,21.11 59.69,21.11 R7.2
N$46
  Top 0.254: R4.1 60.17,12.6 61.94,12.6 LTX.A
N$47
  Top 0.254: R5.1 L5V.A
N$48
  Top 0.254: R6.1 49.24,15.91 50.51,15.91 LEXE.A
VCC  (via drill 0.61, 0.61 pad 1.27)
  Top 0.254: 53.05,39.27 IC1.1 | v34.51,23.53 34.77,23.78 34.77,24.54 U$6.P$17 | R5.2 42.64,12.86 41.62,13.87 C5.1 | R5.2 39.85,11.59 SV1.8 | R5.2
  Top 0.813: v48.74,39.27 53.05,39.27
  Route15 0.254: 37.15,32.45 38.16,32.45 SV2.8
  Bottom 0.254: v48.74,39.27 45.18,39.27 42.13,36.23 41.62,36.23 SV2.8 36.54,31.15 36.54,28.1 38.07,26.57 C3.1
  pour Route15: 27.94,40.32 27.94,8.89 67.63,8.57 67.63,11.11 37.15,11.11 37.15,40.32
  pour Route15: 37.15,40.32 37.15,37.78 65.09,37.78 65.09,9.84 67.63,9.84 67.63,40.32
  pour Route15: 27.94,11.11 27.94,8.57 67.63,8.57 67.63,11.11
VDD  (via drill 0.61, 0.61 pad 1.27)
  Top 0.254: 42.39,35.97 38.83,35.97 SV2.6 37.31,34.45 37.31,32.67 35.78,31.15 35.78,30.13 35.53,29.88 35.53,29.11 U$6.P8 | v47.21,23.02 46.96,22.76 46.96,21.24 U$1.18 | 42.39,35.97 42.89,35.97 45.43,33.43 45.43,32.67 U$1.40 | 42.39,35.97 C4.1 | v43.4,28.1 43.4,27.34 41.37,25.3 40.61,25.3 U$1.8 | v56.58,34.51 56.61,31.15 56.61,30.38 54.83,28.61 52.04,28.61 U$1.30 | 53.31,34.45 IC1.3 | v38.32,23.53 37.31,24.54 36.8,24.54 U$6.P$20 | v54.83,16.67 54.83,17.43 U$4.20
  Top 0.813: v56.58,34.51 53.31,34.45
  Route15 0.254: v38.32,23.53 38.42,23.05
  Bottom 0.254: U$5.P$7 41.12,26.83 41.12,28.1 U$5.P$8 40.86,28.1 42.13,29.37 | U$5.P$3 v47.72,25.56 | U$3.P$1 32.99,34.45 35.53,36.99 37.31,36.99 SV2.6 | 42.13,29.37 42.64,29.88 42.64,30.64 R1.2 | v43.4,28.1 42.13,29.37 | IC2.8 51.02,28.35 53.02,28.35 arc90 53.34,28.67 53.34,30.96 | v54.83,16.67 54.83,17.18 52.55,19.46 C6.1 | C1.1 58.39,34.7 56.61,34.7 v56.58,34.51 56.36,34.45 53.75,31.37 53.34,30.96 | 53.34,30.96 arc-67 53.34,30.96
  pour Route15: 38.42,36.51 38.42,12.38 63.82,12.38 63.82,36.51
VSS  (via drill 0.6, 0.61, 0.61 pad 1.27)
  Top 0.254: C8.2 63.21,20.48 63.72,19.97 63.72,19.72 v64.48,18.95 64.99,18.45 64.99,14.89 64.23,14.13 LRX.C | 46.2,30.38 46.2,32.42 U$1.39 | U$1.17 46.2,21.24 46.2,26.19 | 40.61,27.59 40.61,26.83 U$1.6 | v61.94,23.53 60.67,23.53 U$4.10 | v53.82,26.07 52.04,26.07 U$1.27 | 40.35,27.59 U$1.5 40.61,27.59 | 64.23,12.7 64.23,12.6 LTX.C 63.98,12.35 63.21,11.59 L5V.C | 40.61,27.59 41.37,27.59 41.88,28.1 41.88,28.86 42.39,29.37 42.39,29.62 43.15,30.38 46.2,30.38 | C7.2 62.2,40.04 62.2,39.53 59.66,36.99 IC1.4 59.4,36.99 59.15,36.73 | C5.2 41.37,15.65 38.83,15.65 SV1.4 | v34.77,30.38 34.77,29.11 U$6.P9 | 46.2,26.19 46.2,30.38 | 46.2,26.19 v44.77,26.19 | v29.37,19.24 29.37,19.21 30.8,17.78 30.64,17.62 C9.2 | SV2.4 38.83,38 42.39,38 C4.2 | v51.53,17.18 52.8,15.91 LEXE.C
  Top 0.61: 64.23,12.7 64.23,14.13
  Top 0.813: IC1.2 55.43,36.99 arc45 55.66,37.08 v55.72,37.15 59.17,37.15 arc-45 59.39,37.05 IC1.4
  Bottom 0.254: U$3.P$4 32.99,22.76 33.75,22 U$2.P$6 | v38.32,30.89 38.32,29.37 C3.2 | 49.75,22.51 48.99,22.51 IC2.4 | 49.75,22.51 50.26,22.51 | IC2.3 49.75,22.51 | 50.26,22.51 50.26,23.78 | 50.26,23.78 50.26,26.07 | 50.26,26.07 50.26,28.1 IC2.7 50.26,28.35 | 50.26,22.51 51.02,22.51 IC2.1 | 50.26,22.51 IC2.2 | 50.26,23.78 52.55,21.49 C6.2 | X1.GND 49.24,34.45 49.24,31.65 | U$5.P$4 48.29,24.29 arc45 48.51,24.38 v48.58,24.45 | 50.26,26.07 49.82,26.07 arc45 49.6,25.97 v49.37,25.75 | 49.24,31.65 49.24,31.59 | v64.48,18.95 63.98,19.46 59.91,19.46 R7.1 | 56.1,36.73 58.39,36.73 C1.2 | 56.1,36.73 55.85,36.99 v55.72,37.15 56.1,36.73 | 49.24,31.65 49.75,31.15 51.78,31.15 arc45 52,31.24 v53.18,32.42
  pour Route2: 27.94,40.32 27.94,9.84 67.63,9.84 67.63,40.32